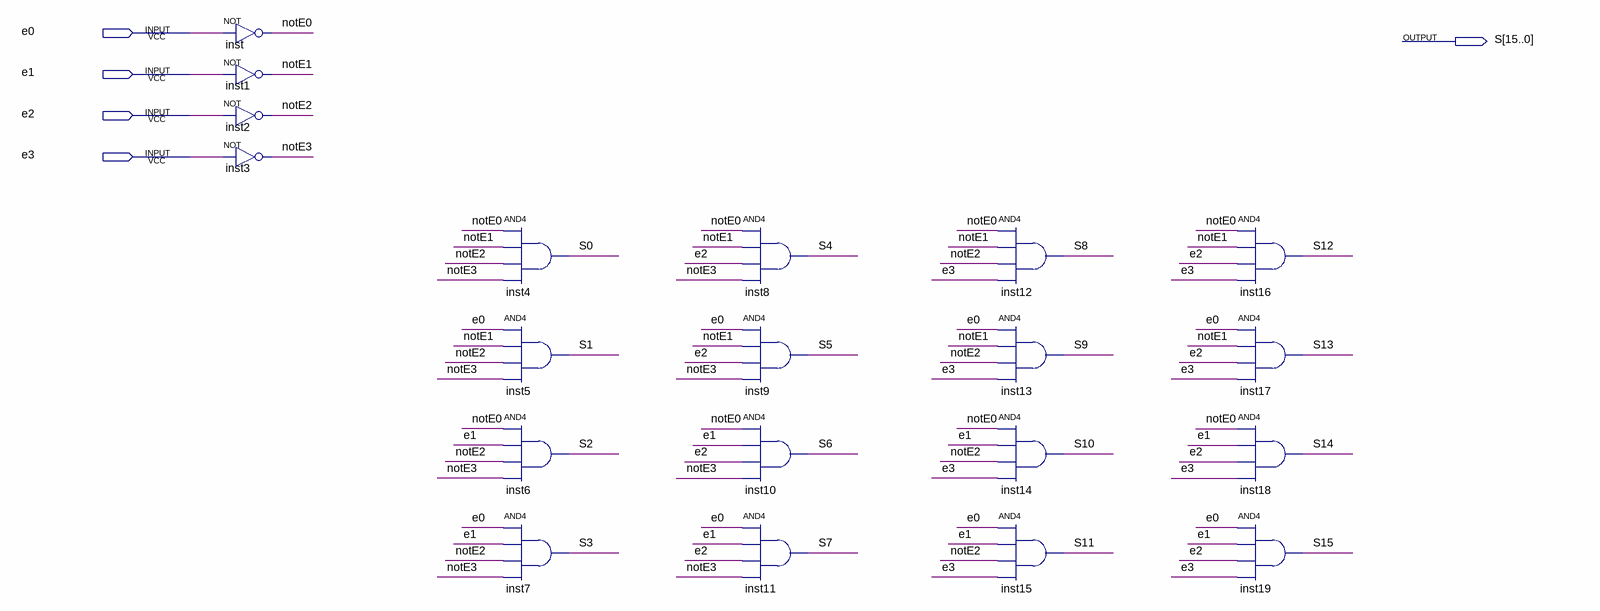
[diagram p0: schematic sheet]
// Quartus schematic decod4x16.bdf as structural Verilog: 20 symbols, 5 pins
module decod4x16 (
  input  e0,
  input  e1,
  input  e2,
  input  e3,
  output [15:0] S
);

  wire notE0, notE1, notE2, notE3;

  not inst (notE0, e0);
  not inst1 (notE1, e1);
  not inst2 (notE2, e2);
  not inst3 (notE3, e3);
  and inst4 (S[0], notE0, notE1, notE2, notE3);
  and inst5 (S[1], e0, notE1, notE2, notE3);
  and inst6 (S[2], notE0, e1, notE2, notE3);
  and inst7 (S[3], e0, e1, notE2, notE3);
  and inst8 (S[4], notE0, notE1, e2, notE3);
  and inst9 (S[5], e0, notE1, e2, notE3);
  and inst10 (S[6], notE0, e1, e2, notE3);
  and inst11 (S[7], e0, e1, e2, notE3);
  and inst12 (S[8], notE0, notE1, notE2, e3);
  and inst13 (S[9], e0, notE1, notE2, e3);
  and inst14 (S[10], notE0, e1, notE2, e3);
  and inst15 (S[11], e0, e1, notE2, e3);
  and inst16 (S[12], notE0, notE1, e2, e3);
  and inst17 (S[13], e0, notE1, e2, e3);
  and inst18 (S[14], notE0, e1, e2, e3);
  and inst19 (S[15], e0, e1, e2, e3);
endmodule
